# EAGLE design IO_Top_Board (EAGLE 9.0.0)
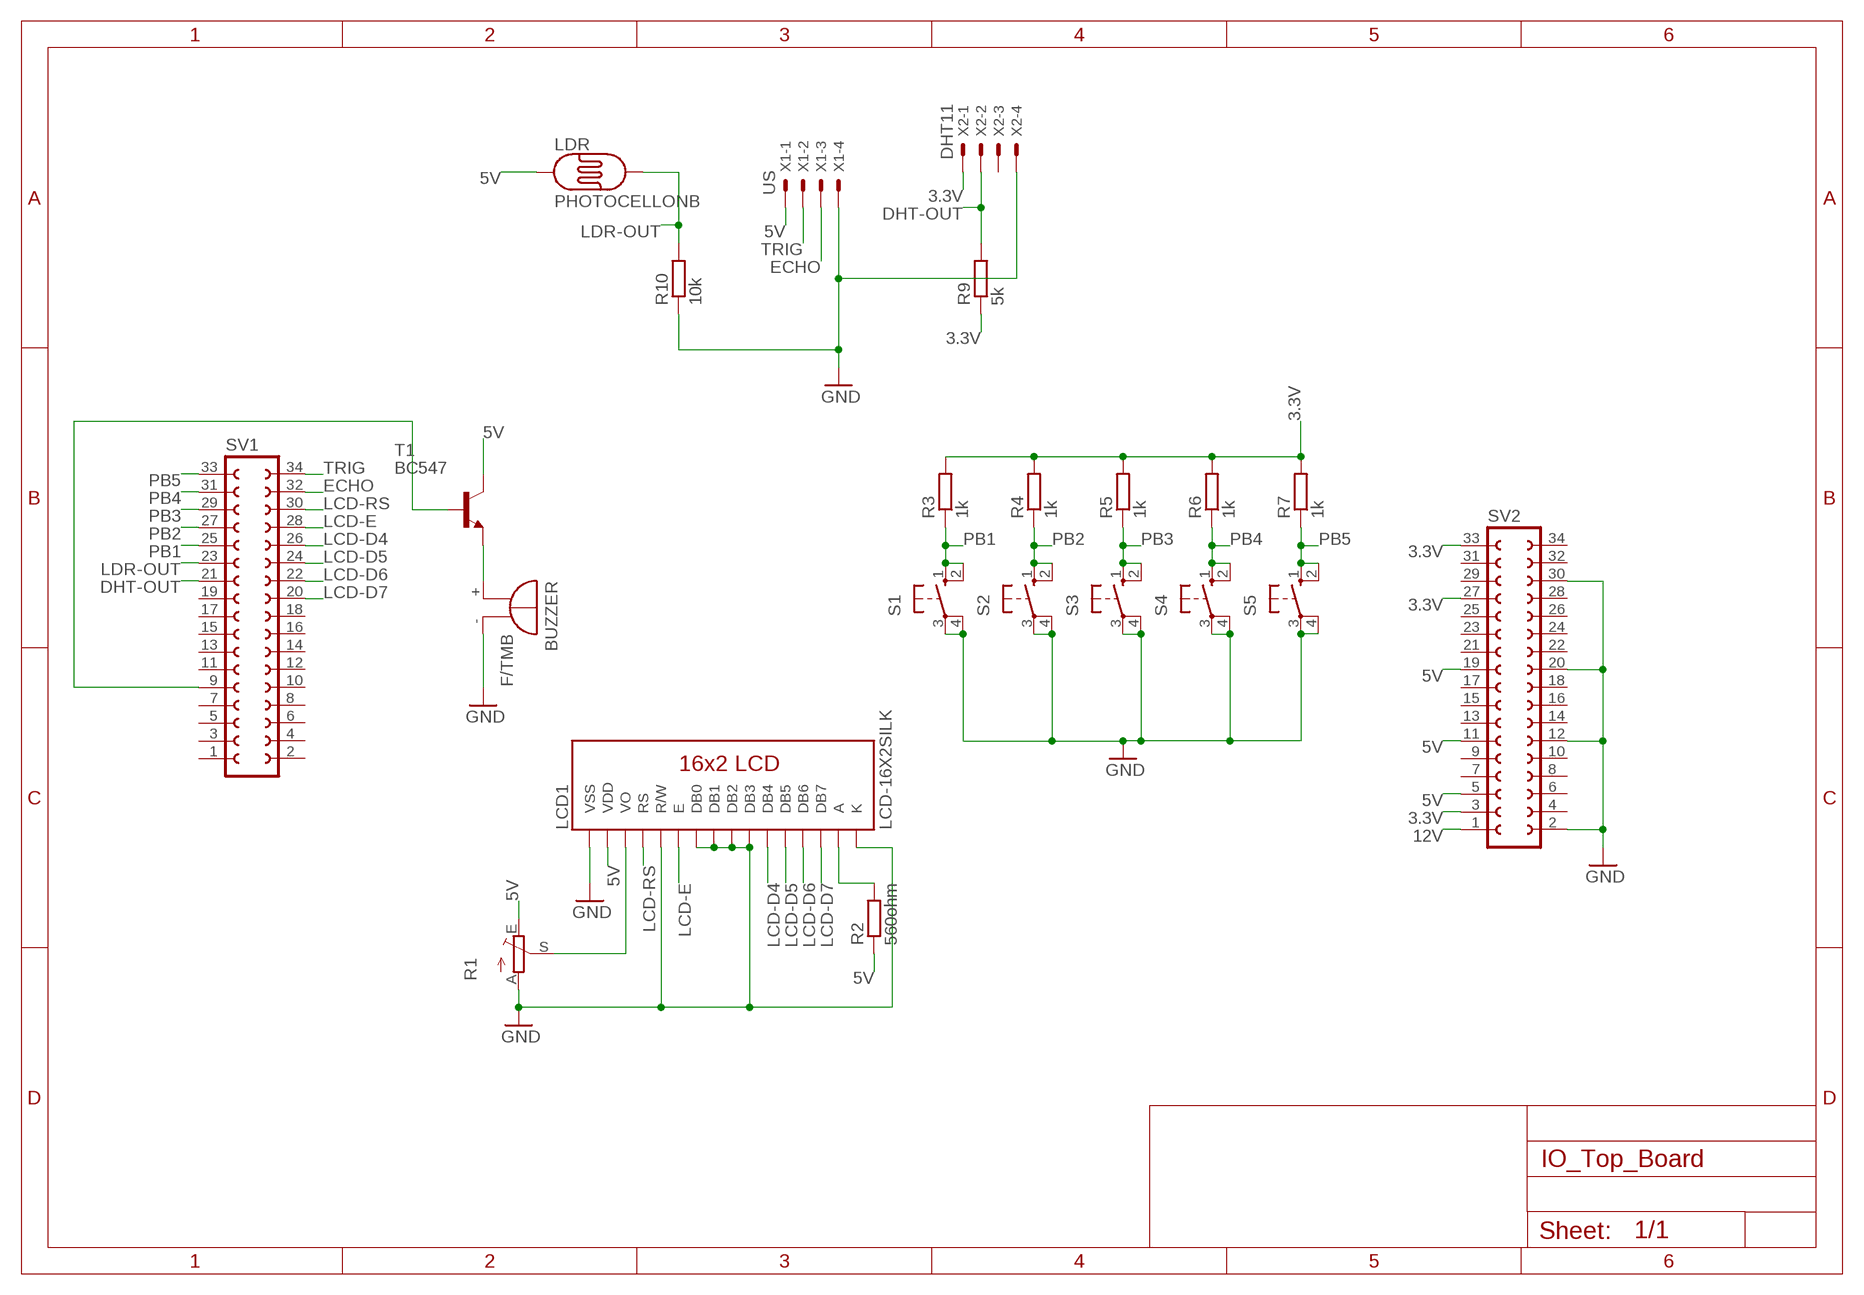
[diagram p0: schematic, sheet 1]

## Parts
BUZZER  F/TMB  [F/TMB]
LCD1  LCD-16X2SILK  [LCD-16X2]
LDR  PHOTOCELLONB  [ON_BOARD]
R1  TRIM_EU-CA6V  [CA6V]
R2  560ohm  R-EU_M0805  [M0805]
R3  1k  R-EU_M0805  [M0805]
R4  1k  R-EU_M0805  [M0805]
R5  1k  R-EU_M0805  [M0805]
R6  1k  R-EU_M0805  [M0805]
R7  1k  R-EU_M0805  [M0805]
R9  5k  R-EU_M0805  [M0805]
R10  10k  R-EU_M0805  [M0805]
S1  10-XX  [B3F-10XX]
S2  10-XX  [B3F-10XX]
S3  10-XX  [B3F-10XX]
S4  10-XX  [B3F-10XX]
S5  10-XX  [B3F-10XX]
SV1  FE17-2W  [FE17-2W]
SV2  FE17-2W  [FE17-2W]
T1  BC547  [TO92]
X1  US  22-23-2041  [22-23-2041]
X2  DHT11  22-23-2041  [22-23-2041]

## Nets
3.3V: R3.2 R4.2 R5.2 R6.2 R7.2 R9.1 SV2.3 SV2.27 SV2.33 X2.1
5V: LCD1.2(VDD) LDR.1 R1.E R2.1 SV2.5 SV2.11 SV2.19 T1.3(C) X1.1
12V: SV2.1
DHT-OUT: R9.2 SV1.21 X2.2
ECHO: SV1.32 X1.3
GND: BUZZER.- LCD1.1(VSS) LCD1.5(R/W) LCD1.7(DB0) LCD1.8(DB1) LCD1.9(DB2) LCD1.10(DB3) LCD1.16(K) R1.A R10.1 S1.3(P) S1.4(P1) S2.3(P) S2.4(P1) S3.3(P) S3.4(P1) S4.3(P) S4.4(P1) S5.3(P) S5.4(P1) SV2.2 SV2.12 SV2.20 SV2.30 X1.4 X2.4
LCD-D4: LCD1.11(DB4) SV1.26
LCD-D5: LCD1.12(DB5) SV1.24
LCD-D6: LCD1.13(DB6) SV1.22
LCD-D7: LCD1.14(DB7) SV1.20
LCD-E: LCD1.6(E) SV1.28
LCD-RS: LCD1.4(RS) SV1.30
LDR-OUT: LDR.2 R10.2 SV1.23
N$1: SV1.9 T1.2(B)
N$2: LCD1.3(VO) R1.S
N$3: BUZZER.+ T1.1(E)
N$4: LCD1.15(A) R2.2
PB1: R3.1 S1.1(S) S1.2(S1) SV1.25
PB2: R4.1 S2.1(S) S2.2(S1) SV1.27
PB3: R5.1 S3.1(S) S3.2(S1) SV1.29
PB4: R6.1 S4.1(S) S4.2(S1) SV1.31
PB5: R7.1 S5.1(S) S5.2(S1) SV1.33
TRIG: SV1.34 X1.2
Unconnected: SV1.1 SV1.2 SV1.3 SV1.4 SV1.5 SV1.6 SV1.7 SV1.8 SV1.10 SV1.11 SV1.12 SV1.13 SV1.14 SV1.15 SV1.16 SV1.17 SV1.18 SV1.19 SV2.4 SV2.6 SV2.7 SV2.8 SV2.9 SV2.10 SV2.13 SV2.14 SV2.15 SV2.16 SV2.17 SV2.18 SV2.21 SV2.22 SV2.23 SV2.24 SV2.25 SV2.26 SV2.28 SV2.29 SV2.31 SV2.32 SV2.34 X2.3

## Library data of the parts
BUZZER = buzzer:F/TMB: BUZZER Source: Buerklin; OC_FARNELL: unknown; OC_NEWARK: unknown
LCD1 = SparkFun-Displays:LCD-16X2: Standard text-only 16x2 parallel input LCD Basic 16 character by 2 line display. Typically utilizes the extremely common HD44780 parallel interface chipset SparkFun Products: Basic 16x2 Green <https://www.sparkfun.com/products/255> Basic 8x2 Green <https://www.sparkfun.com/products/11122>; SF_ID: LCD-00255
LDR = LDR:PHOTOCELL: Photo Resitor
R1 = pot:TRIM_EU-: POTENTIOMETER
R2-R7 R9 R10 = rcl:R-EU_: RESISTOR, European symbol; SPICEPREFIX: R
S1-S5 = switch-omron:10-XX: OMRON SWITCH; MPN: B3F-1000; OC_FARNELL: 176432; OC_NEWARK: 36M3542
SV1 SV2 = con-lsta:FE17-2W: FEMALE HEADER; OC_FARNELL: unknown; OC_NEWARK: unknown
T1 = transistor:BC547: NPN TRANSISTOR
X1 X2 = con-molex:22-23-2041: .100" (2.54mm) Center Header - 4 Pin; MF: MOLEX; MPN: 22-23-2041; OC_FARNELL: 1462920; OC_NEWARK: 38C0355

## Board
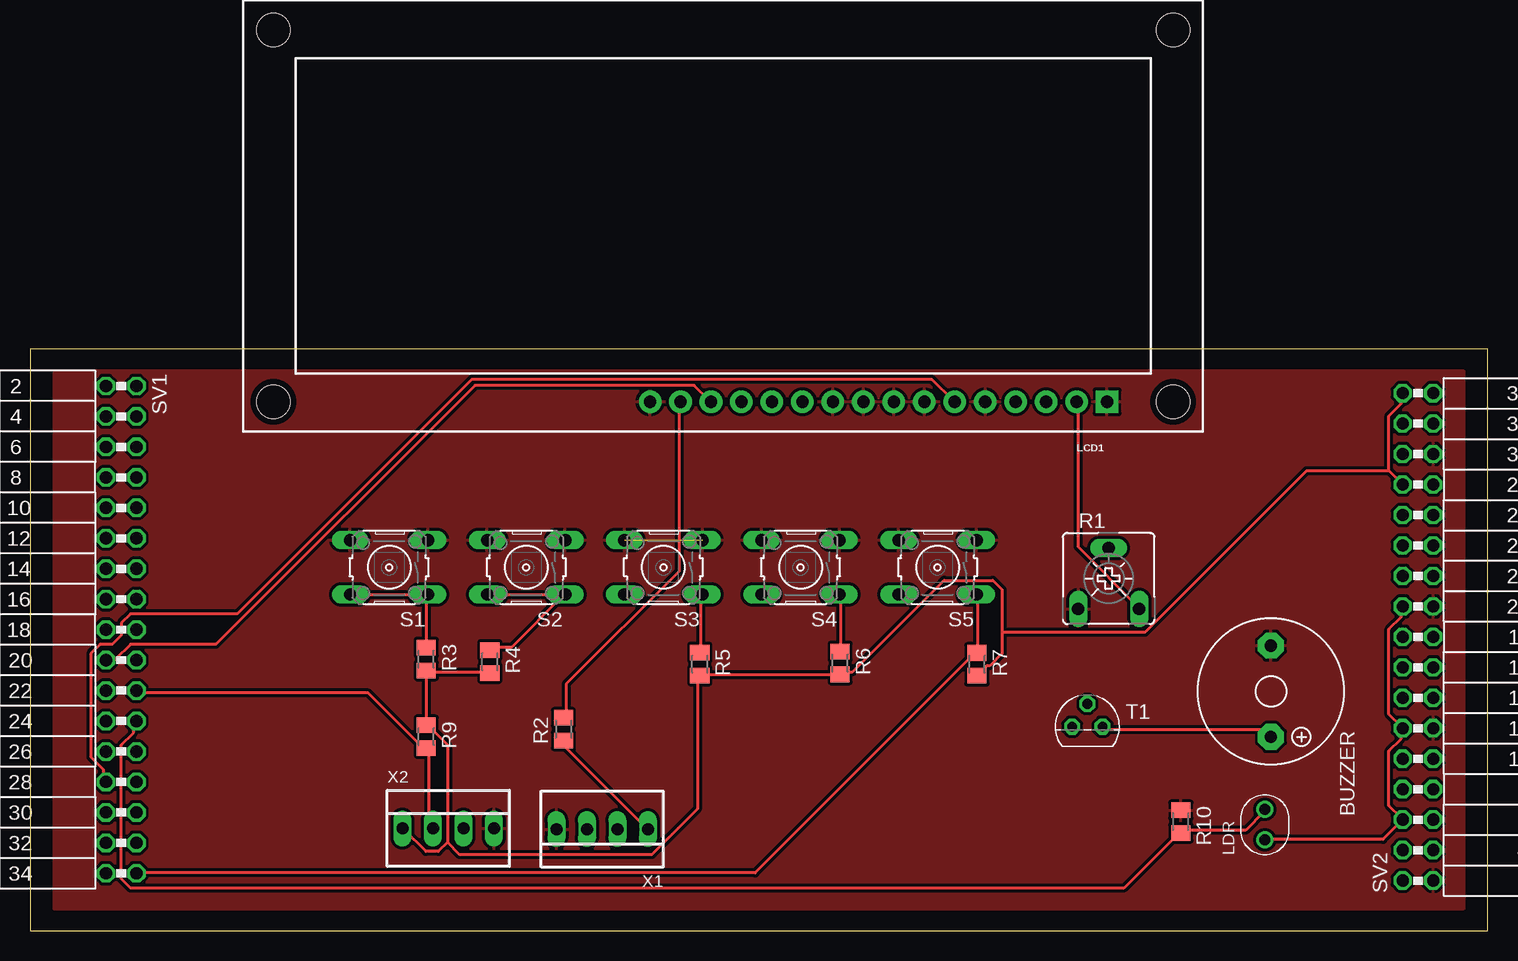
[diagram p1: board, top side]
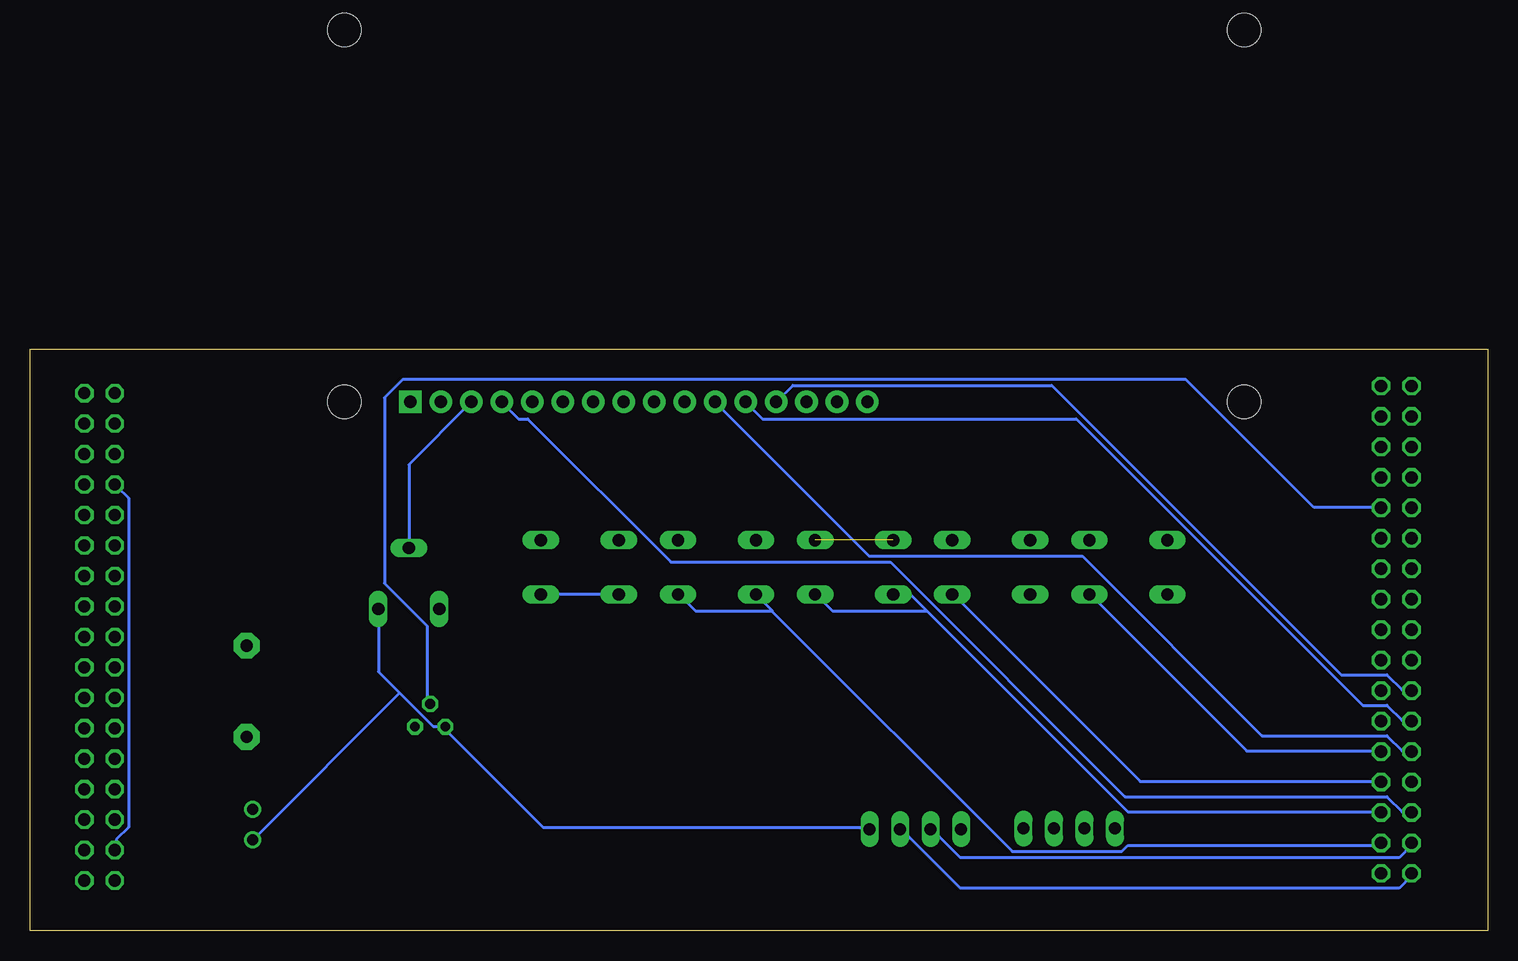
[diagram p2: board, bottom side, seen from below]

Size 121.5 x 48.5 mm. Coordinates in mm from the lower left corner, seen from the top.
Outline: 0,0 121.5,0 121.5,48.5 0,48.5 0,0
Copper layers (1*16): Top 0.035mm / dielectric 1.5mm / Bottom 0.035mm
Design rules "default *": minimum track width 10mil, minimum drill 0.35mm, track to track 10mil, track to pad 10mil, pad to pad 10mil, via to via 10mil, smd to smd 6mil, copper to edge 20mil, drill to drill 6mil, minimum pad ring 10mil, minimum via ring 8mil, stop-mask expansion 4mil, vias tented up to drill 0mil, thermal gap 10mil

### Footprints (pad centres in the part's own frame; a part is rotated, then mirrored left to right if it is on the bottom)
F/TMB = drill 1.016 pad 2.159 octagon: + 3.81,0; - -3.81,0
LCD-16X2 = drill 1.016 pad 1.88 square: 1 -32,15.5 | drill 1.016 pad 1.88: 2 -29.46,15.5; 3 -26.92,15.5; 4 -24.38,15.5; 5 -21.84,15.5; 6 -19.3,15.5; 7 -16.76,15.5; 8 -14.22,15.5; 9 -11.68,15.5; 10 -9.14,15.5; 11 -6.6,15.5; 12 -4.06,15.5; 13 -1.52,15.5; 14 1.02,15.5; 15 3.56,15.5; 16 6.1,15.5 | hole 2.8: -37.5,15.5; -37.5,-15.5; 37.5,15.5; 37.5,-15.5
ON_BOARD = drill 0.9: 1 -1.27,0; 2 1.27,0
CA6V = drill 1.016 long: A -2.54,-2.54; E 2.54,-2.54; S 0,2.54
M0805 = smd 1.3 x 1.6: 1 -0.95,0; 2 0.95,0
B3F-10XX = drill 1.016 long: 1 -3.251,2.261; 2 3.251,2.261; 3 -3.251,-2.261; 4 3.251,-2.261
FE17-2W = drill 1.016 octagon: 1 -20.32,1.27; 2 -20.32,-1.27; 3 -17.78,1.27; 4 -17.78,-1.27; 5 -15.24,1.27; 6 -15.24,-1.27; 7 -12.7,1.27; 8 -12.7,-1.27; 9 -10.16,1.27; 10 -10.16,-1.27; 11 -7.62,1.27; 12 -7.62,-1.27; 13 -5.08,1.27; 14 -5.08,-1.27; 15 -2.54,1.27; 16 -2.54,-1.27; 17 0,1.27; 18 0,-1.27; 19 2.54,1.27; 20 2.54,-1.27; 21 5.08,1.27; 22 5.08,-1.27; 23 7.62,1.27; 24 7.62,-1.27; 25 10.16,1.27; 26 10.16,-1.27; 27 12.7,1.27; 28 12.7,-1.27; 29 15.24,1.27; 30 15.24,-1.27; 31 17.78,1.27; 32 17.78,-1.27; 33 20.32,1.27; 34 20.32,-1.27
TO92 = drill 0.813 octagon: 1 1.27,0; 2 0,1.905; 3 -1.27,0
22-23-2041 = drill 1 long: 1 -3.81,0; 2 -1.27,0; 3 1.27,0; 4 3.81,0

### Placement (x,y rotation side)
BUZZER  103.45,19.96 270 top
LCD1  57.79,59.6 180 top
LDR  102.94,8.84 90 top
R1  89.92,29.37 0 top
R2  44.47,16.81 90 top
R3  33.03,22.65 270 top
R4  38.33,22.44 270 top
R5  55.83,22.23 270 top
R6  67.53,22.32 270 top
R7  78.93,22.21 270 top
R9  33.03,16.18 270 top
R10  95.93,9.1 270 top
S1  29.94,30.3 180 top
S2  41.37,30.3 180 top
S3  52.8,30.3 180 top
S4  64.23,30.3 180 top
S5  75.66,30.3 180 top
SV1  7.6,25.1 270 top
SV2  115.7,24.5 90 top
T1  88.14,17.01 0 top
X1  47.7,8.47 180 top
X2  34.87,8.53 0 top

### Tracks (layer width: path | path; a pad name or v marks a point on that pad's centre or on a via)
3.3V
  Top 0.254: 113.28,38.35 113.28,42.93 114.3,43.94 114.3,44.7 SV2.33 | 113.28,38.35 114.3,37.34 SV2.27 | R4.2 38.1,21.59 33.27,21.59 R3.2 33.02,21.59 33.02,17.27 R9.1 33.27,17.02 34.8,15.49 34.8,7.37 | 34.8,7.37 34.04,6.6 33.02,6.6 31.24,8.38 X2.1 | 81.03,24.89 81.03,28.45 80.26,29.21 76.2,29.21 68.58,21.59 67.56,21.59 R6.2 67.31,21.34 55.88,21.34 R5.2 55.63,21.08 55.63,10.16 51.82,6.35 35.81,6.35 34.8,7.37 | 81.03,24.89 81.03,23.11 80.01,22.1 79.76,22.1 78.99,21.34 R7.2 | 113.28,38.35 106.43,38.35 92.96,24.89 81.03,24.89
  Bottom 0.254: SV2.3 114.3,6.86 114.3,7.62 113.28,8.64 113.28,36.07 114.3,37.08 SV2.27
5V
  Top 0.254: LDR.1 103.12,7.62 112.78,7.62 114.3,9.14 SV2.5 114.3,9.4 113.28,10.41 113.28,14.99 114.3,16 114.3,16.76 SV2.11 114.3,17.02 113.28,18.03 113.28,25.15 114.3,26.16 114.3,26.92 SV2.19 | R2.1 44.7,15.75 44.7,15.24 51.31,8.64 X1.1 | LCD1.2 87.38,43.94 87.38,32 92.46,26.92 R1.E
  Bottom 0.254: 90.68,19.81 92.46,21.59 92.46,26.67 R1.E | 90.68,19.81 87.88,17.02 87.12,17.02 T1.3 86.87,16.76 78.74,8.64 51.56,8.64 X1.1 | 90.68,19.81 102.87,7.62 LDR.1
DHT-OUT
  Top 0.254: X2.2 33.53,8.64 33.27,8.89 33.27,14.99 R9.2 33.02,14.99 28.19,19.81 8.89,19.81 SV1.21
ECHO
  Bottom 0.254: X1.3 46.23,8.38 43.94,6.1 7.37,6.1 6.35,7.11 SV1.32
GND  (1 unrouted)
  pour Top: 2.9,46.7 119.5,46.7 119.5,1.8 2,1.8 2,46.7
LCD-D4
  Bottom 0.254: SV1.26 6.35,14.99 7.11,14.99 8.38,16.26 18.8,16.26 33.78,31.24 51.56,31.24 64.26,43.94 LCD1.11
LCD-D5
  Bottom 0.254: SV1.24 6.35,17.53 7.11,17.53 8.38,18.8 10.41,18.8 34.29,42.67 60.45,42.67 61.72,43.94 LCD1.12
LCD-D6
  Bottom 0.254: SV1.22 6.35,20.07 7.11,20.07 8.38,21.34 12.19,21.34 36.32,45.47 57.91,45.47 59.18,44.2 LCD1.13
LCD-D7
  Top 0.254: SV1.20 6.35,22.61 7.11,22.61 8.38,23.88 15.49,23.88 37.08,45.47 55.37,45.47 56.64,44.2 LCD1.14
LCD-E
  Top 0.254: SV1.28 6.1,12.45 6.1,13.46 5.08,14.48 5.08,23.11 5.84,23.88 6.86,23.88 7.62,24.64 7.62,25.65 8.38,26.42 17.27,26.42 36.83,45.97 75.18,45.97 76.96,44.2 LCD1.6
LCD-RS
  Bottom 0.254: SV1.30 6.35,9.91 7.11,9.91 8.38,11.18 30.23,11.18 49.78,30.73 68.07,30.73 80.01,42.67 80.77,42.67 82.04,43.94 LCD1.4
LDR-OUT
  Top 0.254: LDR.2 102.87,9.91 101.35,8.38 96.01,8.38 R10.2 95.76,8.13 91.19,3.56 8.38,3.56 7.62,4.32 7.62,15.49 8.64,16.51 8.64,17.27 SV1.23
N$1
  Bottom 0.254: T1.2 88.39,19.05 88.39,25.4 91.95,28.96 91.95,44.45 90.42,45.97 25.15,45.97 14.48,35.31 8.89,35.31 SV1.9
N$2
  Bottom 0.254: R1.S 89.92,32 89.92,38.86 84.84,43.94 LCD1.3
N$3
  Top 0.254: T1.1 89.66,16.76 102.87,16.76 103.38,16.26 BUZZER.+
N$4
  Top 0.254: R2.2 44.7,17.78 44.7,20.57 54.1,29.97 54.1,43.94 LCD1.15
PB1
  Top 0.254: R3.1 33.02,23.62 33.02,27.94 S1.1 S1.2
  Bottom 0.254: SV1.25 8.89,14.99 20.07,14.99 33.02,27.94 S1.1
PB2
  Top 0.254: R4.1 38.35,23.62 40.13,23.62 44.45,27.94 S2.1 S2.2
  Bottom 0.254: SV1.27 8.89,12.45 28.96,12.45 44.45,27.94 S2.1
PB3
  Top 0.254: R5.1 55.88,23.37 55.88,27.94 S3.1
  Bottom 0.254: 46.74,26.67 29.97,9.91 8.89,9.91 SV1.29 | 46.74,26.67 54.61,26.67 55.88,27.94 S3.1 | S3.2 48.1,28.04 46.74,26.67
PB4
  Top 0.254: R6.1 67.56,23.37 67.56,27.94 S4.1
  Bottom 0.254: 59.66,26.64 59.69,26.67 66.04,26.67 67.31,27.94 S4.1 | 59.66,26.64 39.62,6.6 30.48,6.6 29.97,7.11 8.89,7.11 SV1.31 | S4.2 59.66,26.72 59.66,26.64
PB5
  Top 0.254: S5.1 78.99,27.94 78.99,23.37 R7.1 78.74,23.11 60.45,4.83 8.89,4.83 SV1.33
  Bottom 0.254: S5.2 S5.1
TRIG
  Bottom 0.254: X1.2 48.77,8.38 43.94,3.56 7.37,3.56 6.35,4.57 SV1.34